# EAGLE design Hardware-Neuron (EAGLE 9.3.0)
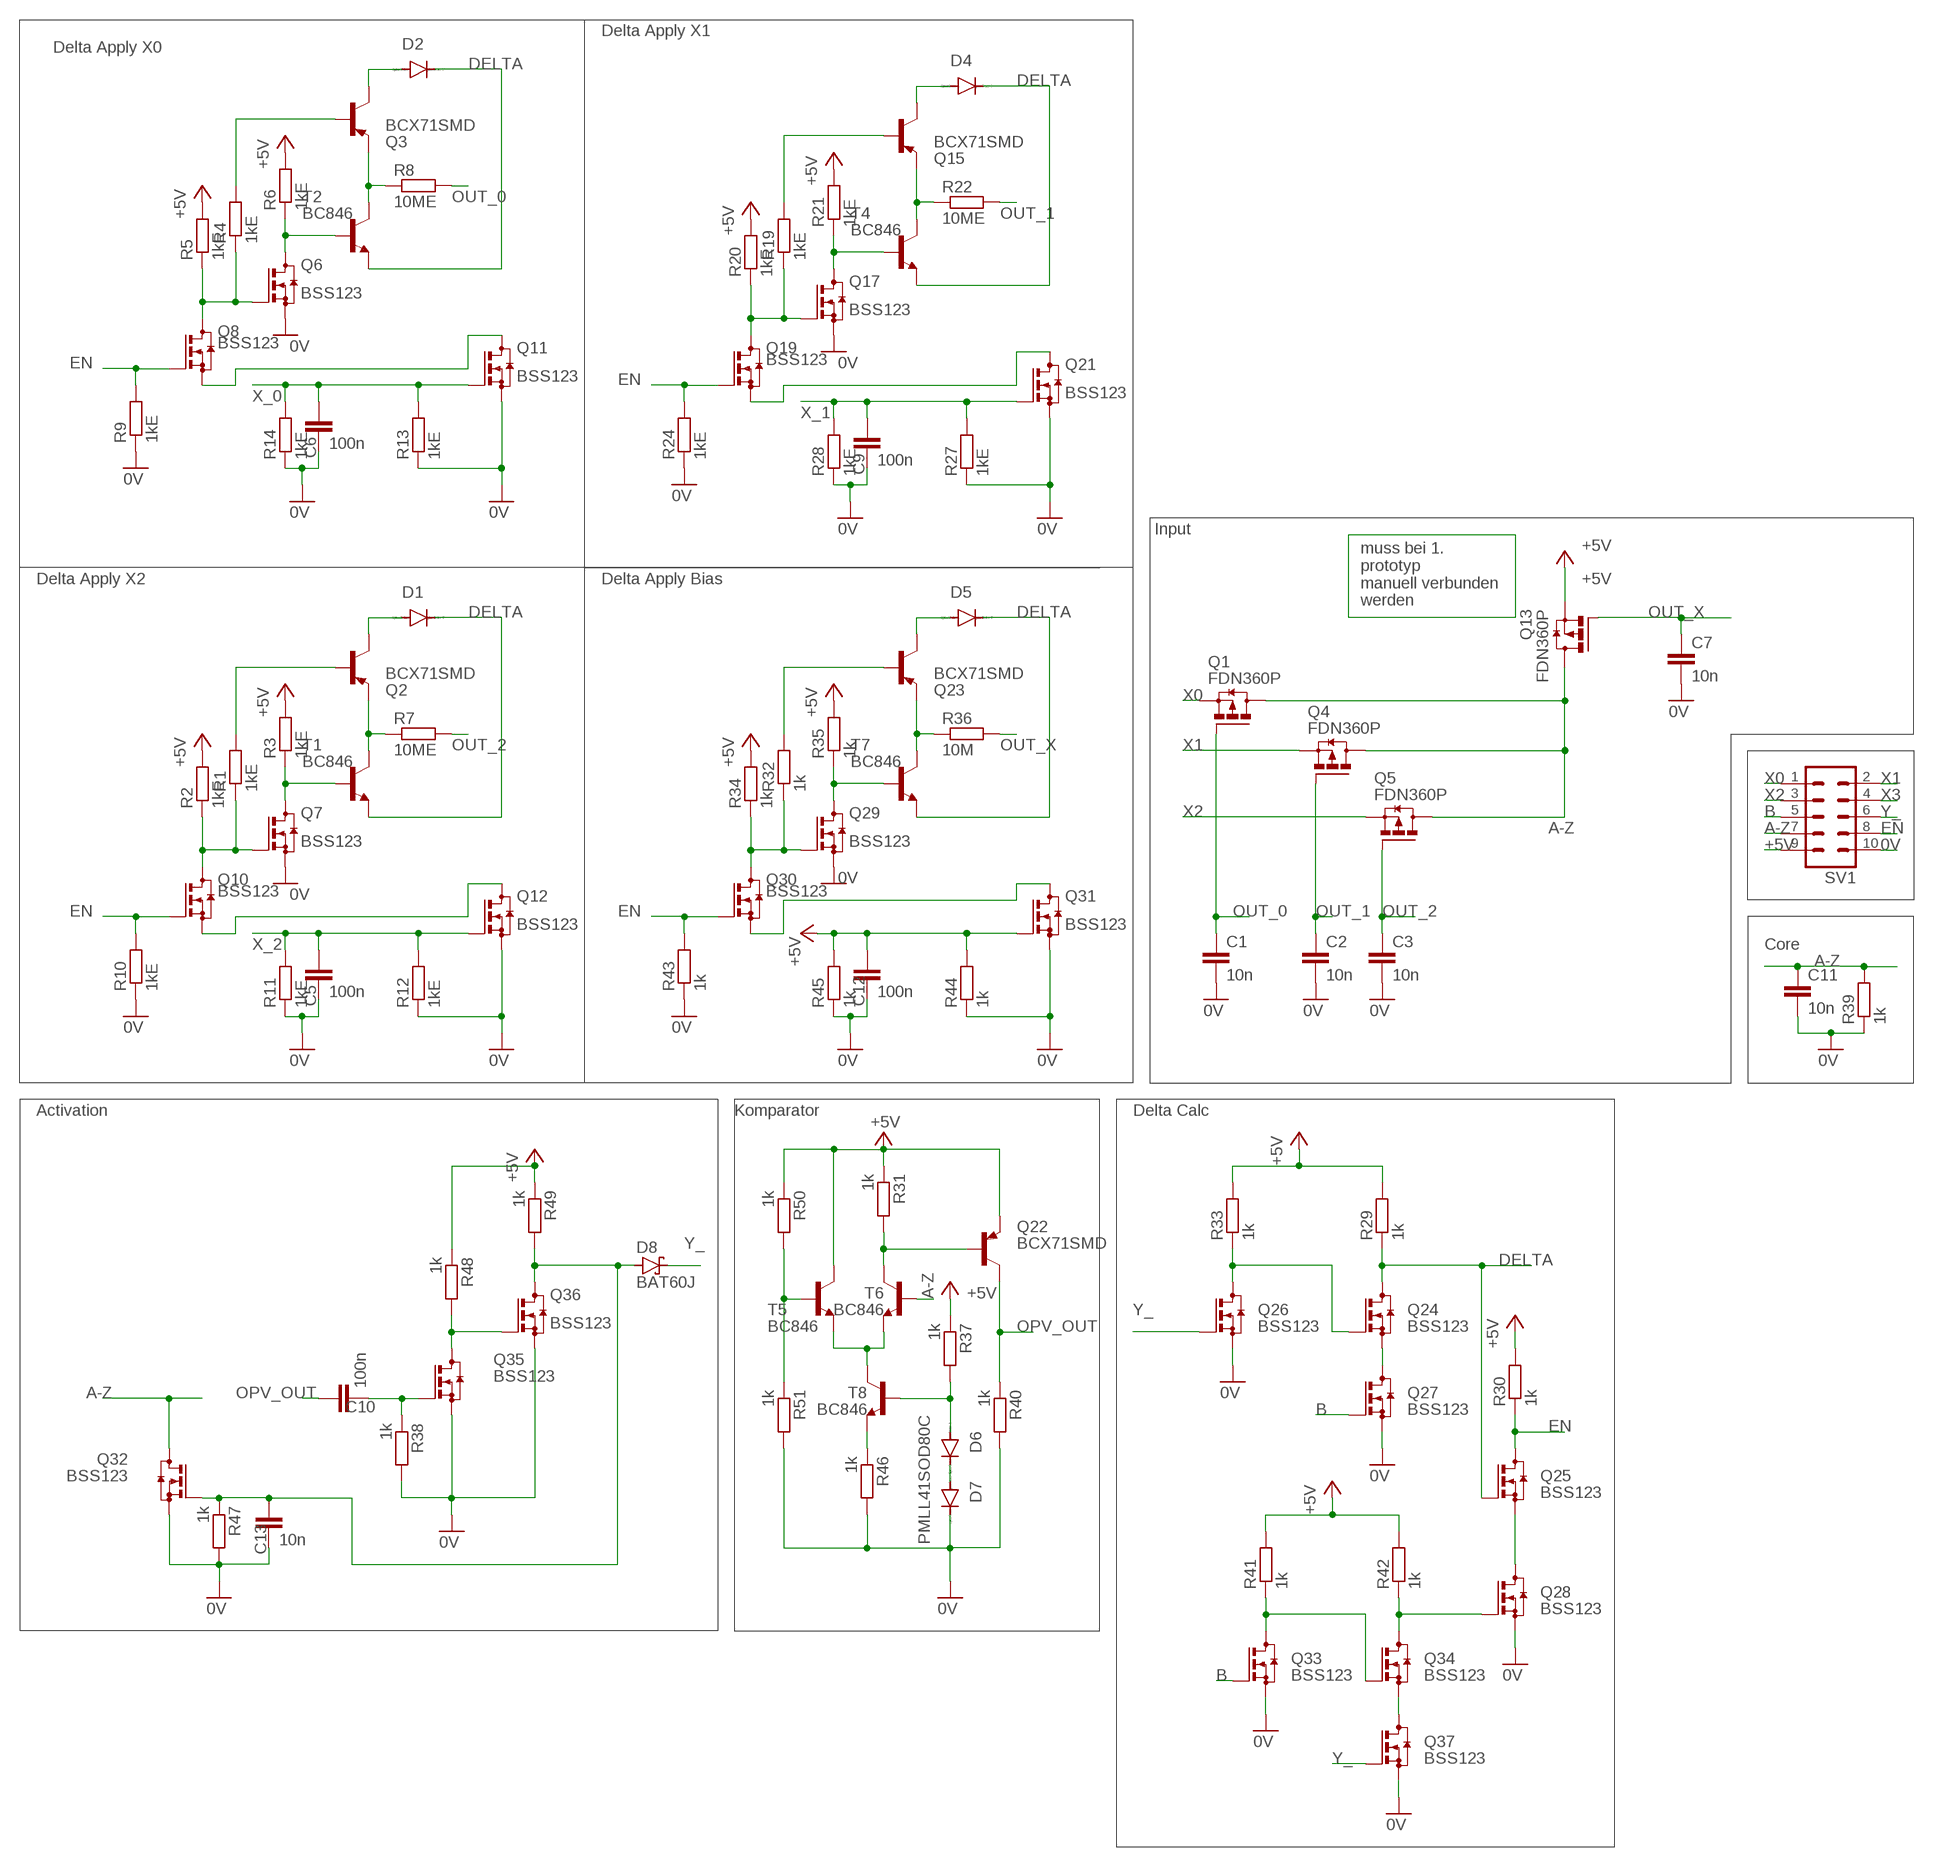
[diagram p0: schematic, sheet 1]

## Parts
C1  10n  C-EUC0805  [C0805]
C2  10n  C-EUC0805  [C0805]
C3  10n  C-EUC0805  [C0805]
C5  100n  C-EUC0805  [C0805]
C6  100n  C-EUC0805  [C0805]
C7  10n  C-EUC0805  [C0805]
C9  100n  C-EUC0805  [C0805]
C10  100n  C-EUC0805  [C0805]
C11  10n  C-EUC0805  [C0805]
C12  100n  C-EUC0805  [C0805]
C13  10n  C-EUC0805  [C0805]
D1  PMLL41SOD80C  [SOD80C]
D2  PMLL41SOD80C  [SOD80C]
D4  PMLL41SOD80C  [SOD80C]
D5  PMLL41SOD80C  [SOD80C]
D6  PMLL41SOD80C  [SOD80C]
D7  PMLL41SOD80C  [SOD80C]
D8  BAT60J  [SOD323_ST]
Q1  FDN360P  [SUPER-SOT3]
Q2  BCX71SMD  [SOT23]
Q3  BCX71SMD  [SOT23]
Q4  FDN360P  [SUPER-SOT3]
Q5  FDN360P  [SUPER-SOT3]
Q6  BSS123  [SOT23]
Q7  BSS123  [SOT23]
Q8  BSS123  [SOT23]
Q10  BSS123  [SOT23]
Q11  BSS123  [SOT23]
Q12  BSS123  [SOT23]
Q13  FDN360P  [SUPER-SOT3]
Q15  BCX71SMD  [SOT23]
Q17  BSS123  [SOT23]
Q19  BSS123  [SOT23]
Q21  BSS123  [SOT23]
Q22  BCX71SMD  [SOT23]
Q23  BCX71SMD  [SOT23]
Q24  BSS123  [SOT23]
Q25  BSS123  [SOT23]
Q26  BSS123  [SOT23]
Q27  BSS123  [SOT23]
Q28  BSS123  [SOT23]
Q29  BSS123  [SOT23]
Q30  BSS123  [SOT23]
Q31  BSS123  [SOT23]
Q32  BSS123  [SOT23]
Q33  BSS123  [SOT23]
Q34  BSS123  [SOT23]
Q35  BSS123  [SOT23]
Q36  BSS123  [SOT23]
Q37  BSS123  [SOT23]
R1  1kE  R-EU_M0805  [M0805]
R2  1kE  R-EU_M0805  [M0805]
R3  1kE  R-EU_M0805  [M0805]
R4  1kE  R-EU_M0805  [M0805]
R5  1kE  R-EU_M0805  [M0805]
R6  1kE  R-EU_M0805  [M0805]
R7  10ME  R-EU_M0805  [M0805]
R8  10ME  R-EU_M0805  [M0805]
R9  1kE  R-EU_M0805  [M0805]
R10  1kE  R-EU_M0805  [M0805]
R11  1kE  R-EU_M0805  [M0805]
R12  1kE  R-EU_M0805  [M0805]
R13  1kE  R-EU_M0805  [M0805]
R14  1kE  R-EU_M0805  [M0805]
R19  1kE  R-EU_M0805  [M0805]
R20  1kE  R-EU_M0805  [M0805]
R21  1kE  R-EU_M0805  [M0805]
R22  10ME  R-EU_M0805  [M0805]
R24  1kE  R-EU_M0805  [M0805]
R27  1kE  R-EU_M0805  [M0805]
R28  1kE  R-EU_M0805  [M0805]
R29  1k  R-EU_M0805  [M0805]
R30  1k  R-EU_M0805  [M0805]
R31  1k  R-EU_M0805  [M0805]
R32  1k  R-EU_M0805  [M0805]
R33  1k  R-EU_M0805  [M0805]
R34  1k  R-EU_M0805  [M0805]
R35  1k  R-EU_M0805  [M0805]
R36  10M  R-EU_M0805  [M0805]
R37  1k  R-EU_M0805  [M0805]
R38  1k  R-EU_M0805  [M0805]
R39  1k  R-EU_M0805  [M0805]
R40  1k  R-EU_M0805  [M0805]
R41  1k  R-EU_M0805  [M0805]
R42  1k  R-EU_M0805  [M0805]
R43  1k  R-EU_M0805  [M0805]
R44  1k  R-EU_M0805  [M0805]
R45  1k  R-EU_M0805  [M0805]
R46  1k  R-EU_M0805  [M0805]
R47  1k  R-EU_M0805  [M0805]
R48  1k  R-EU_M0805  [M0805]
R49  1k  R-EU_M0805  [M0805]
R50  1k  R-EU_M0805  [M0805]
R51  1k  R-EU_M0805  [M0805]
SV1  ML10  [ML10]
T1  BC846  [SOT23]
T2  BC846  [SOT23]
T4  BC846  [SOT23]
T5  BC846  [SOT23]
T6  BC846  [SOT23]
T7  BC846  [SOT23]
T8  BC846  [SOT23]

## Nets
0V: C1.2 C2.2 C3.2 C5.2 C6.2 C7.2 C9.2 C11.2 C12.2 C13.2 D7.C Q6.2(S) Q7.2(S) Q11.2(S) Q12.2(S) Q17.2(S) Q21.2(S) Q26.2(S) Q27.2(S) Q28.2(S) Q29.2(S) Q31.2(S) Q32.2(S) Q33.2(S) Q35.2(S) Q36.2(S) Q37.2(S) R9.1 R10.1 R11.1 R12.1 R13.1 R14.1 R24.1 R27.1 R28.1 R38.2 R39.1 R40.2 R43.1 R44.1 R45.1 R46.2 R47.2 R51.2 SV1.10
+5V: C12.1 Q13.2(S) Q22.2(E) Q31.1(G) R2.2 R3.2 R5.2 R6.2 R20.2 R21.2 R29.2 R30.2 R31.1 R33.2 R34.2 R35.2 R37.1 R41.2 R42.2 R44.2 R45.2 R48.1 R49.1 R50.1 SV1.9 T5.3(C)
A-Z: C11.1 Q1.3(D) Q4.3(D) Q5.3(D) Q13.3(D) Q32.3(D) R39.2 SV1.7 T6.1(B)
B: Q27.1(G) Q33.1(G) SV1.5
DELTA: D1.C D2.C D4.C D5.C Q24.3(D) Q25.1(G) R29.1 T1.2(E) T2.2(E) T4.2(E) T7.2(E)
EN: Q8.1(G) Q10.1(G) Q19.1(G) Q25.3(D) Q30.1(G) R9.2 R10.2 R24.2 R30.1 R43.2 SV1.8
N$1: Q29.3(D) R35.1 T7.1(B)
N$2: Q23.2(E) R36.1 T7.3(C)
N$3: C10.2 Q35.1(G) R38.1
N$5: Q35.3(D) Q36.1(G) R48.2
N$6: Q6.3(D) R6.1 T2.1(B)
N$7: Q8.2(S) Q11.3(D)
N$8: Q3.2(E) R8.1 T2.3(C)
N$9: D5.A Q23.3(C)
N$10: Q23.1(B) R32.2
N$11: Q29.1(G) Q30.3(D) R32.1 R34.1
N$12: Q30.2(S) Q31.3(D)
N$13: D6.C D7.A
N$14: R50.2 R51.1 T5.1(B)
N$16: C13.1 D8.A Q32.1(G) Q36.3(D) R47.1 R49.2
N$25: R46.1 T8.2(E)
N$26: Q22.1(B) R31.2 T6.3(C)
N$27: T5.2(E) T6.2(E) T8.3(C)
N$28: Q17.3(D) R21.1 T4.1(B)
N$29: D6.A R37.2 T8.1(B)
N$30: Q24.1(G) Q26.3(D) R33.1
N$31: D2.A Q3.3(C)
N$32: Q24.2(S) Q27.3(D)
N$33: Q15.2(E) R22.1 T4.3(C)
N$34: Q3.1(B) R4.2
N$35: Q6.1(G) Q8.3(D) R4.1 R5.1
N$36: Q28.1(G) Q34.3(D) R42.1
N$37: Q33.3(D) Q34.1(G) R41.1
N$38: D4.A Q15.3(C)
N$39: Q15.1(B) R19.2
N$40: Q25.2(S) Q28.3(D)
N$41: Q17.1(G) Q19.3(D) R19.1 R20.1
N$42: Q19.2(S) Q21.3(D)
N$43: Q34.2(S) Q37.3(D)
N$50: Q7.3(D) R3.1 T1.1(B)
N$51: Q2.2(E) R7.1 T1.3(C)
N$52: D1.A Q2.3(C)
N$53: Q2.1(B) R1.2
N$54: Q7.1(G) Q10.3(D) R1.1 R2.1
N$55: Q10.2(S) Q12.3(D)
OPV_OUT: C10.1 Q22.3(C) R40.1
OUT_0: C1.1 Q1.1(G) R8.2
OUT_1: C2.1 Q4.1(G) R22.2
OUT_2: C3.1 Q5.1(G) R7.2
OUT_X: C7.1 Q13.1(G) R36.2
X0: Q1.2(S) SV1.1
X1: Q4.2(S) SV1.2
X2: Q5.2(S) SV1.3
X3: SV1.4
X_0: C6.1 Q11.1(G) R13.2 R14.2
X_1: C9.1 Q21.1(G) R27.2 R28.2
X_2: C5.1 Q12.1(G) R11.2 R12.2
Y_: D8.C Q26.1(G) Q37.1(G) SV1.6

## Notes on the sheet
- Delta Apply X1
- Delta Apply X0
- Input
- Delta Apply X2 | Delta Apply Bias
- muss bei 1.
  prototyp 
  manuell verbunden
  werden
- Core
- Activation | Komparator | Delta Calc

## Library data of the parts
C1-C3 C5-C7 C9-C13 = rcl:C-EU: CAPACITOR, European symbol; SPICEPREFIX: C
D1 D2 D4-D7 = diode:PMLL41*: High-speed diodes Source: http://www.semiconductors.philips.com/acrobat_download/datasheets/PMLL4150_2.pdf
D8 = diode:BAT60J: Schottky barrier diode Source: www.st.com, BAT60J.pdf
Q1 Q4 Q5 Q13 = transistor-power:FDN360P: Single P-Channel, PowerTrench (R) MOSFET Source: http://www.fairchildsemi.com/ds/FD/FDN360P.pdf
Q2 Q3 Q15 Q22 Q23 = transistor-pnp:BCX71SMD: PNP Transistor
Q6-Q8 Q10-Q12 Q17 Q19 Q21 Q24-Q37 = transistor-small-signal:BSS123: N-CHANNEL MOS FET
R1-R14 R19-R22 R24 R27-R51 = rcl:R-EU_: RESISTOR, European symbol; SPICEPREFIX: R
SV1 = con-harting-ml:ML10: HARTING; OC_FARNELL: unknown; OC_NEWARK: unknown
T1 T2 T4-T8 = transistor:BC846: NPN TRANSISTOR

## Board
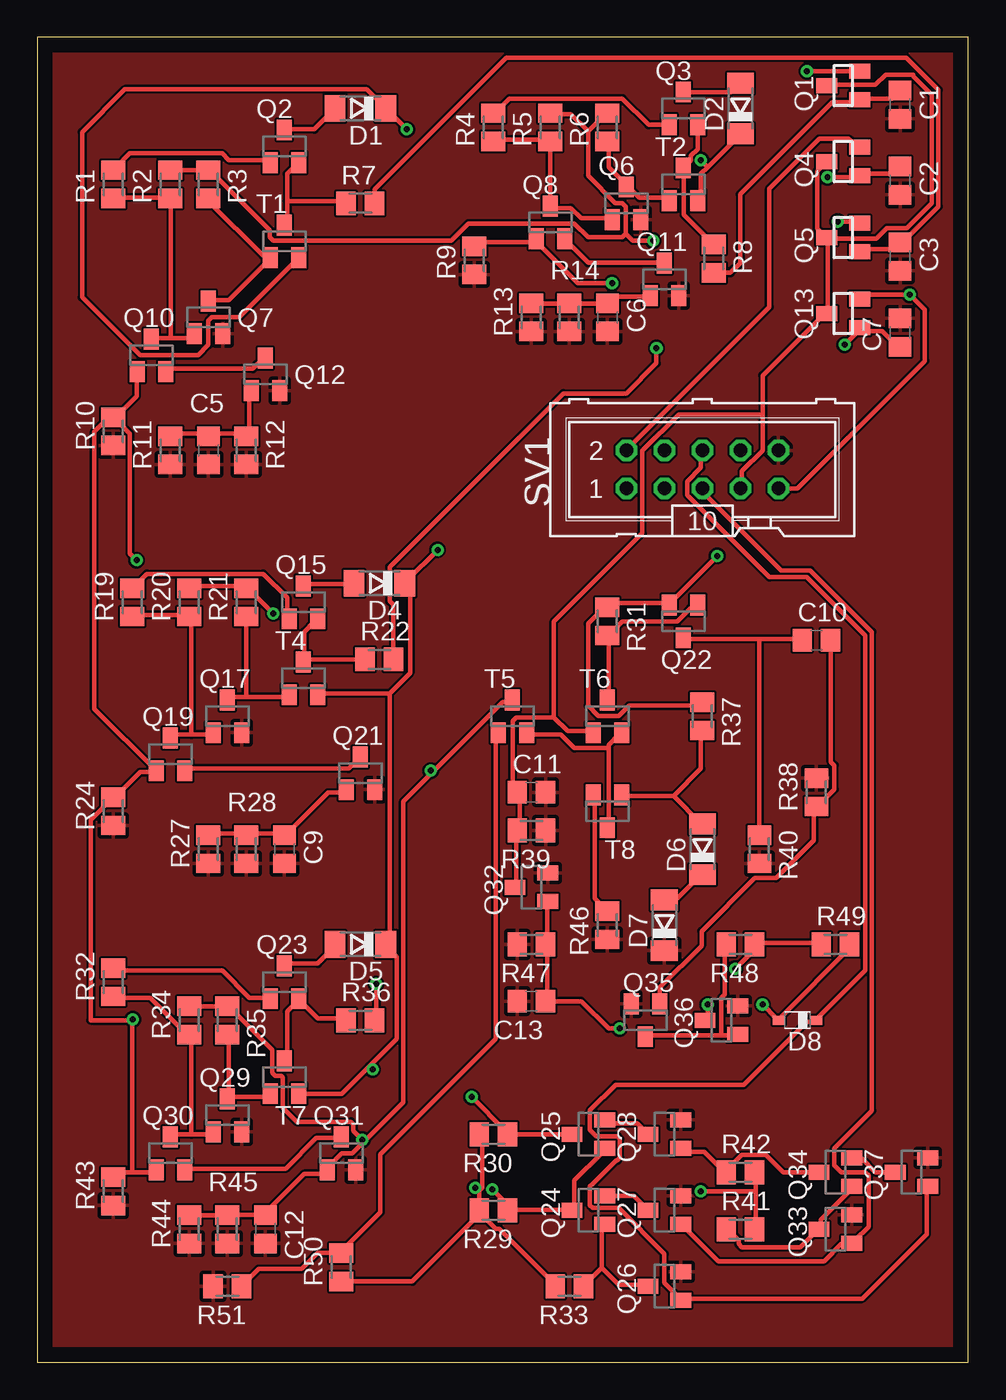
[diagram p1: board, top side]
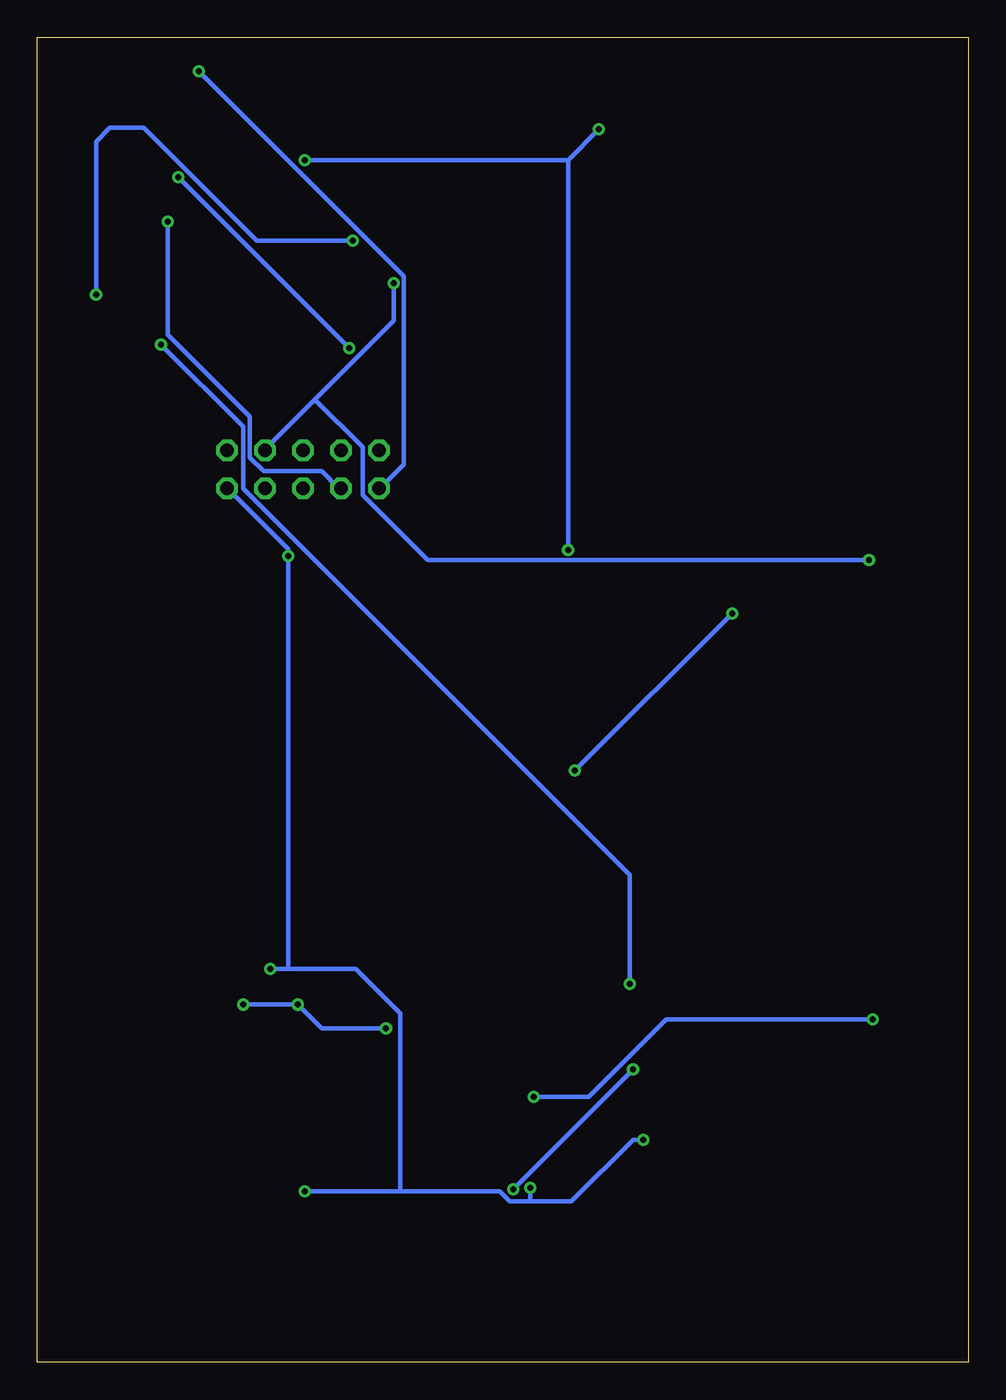
[diagram p2: board, bottom side, seen from below]

Size 62.21 x 88.57 mm. Coordinates in mm from the lower left corner, seen from the top.
Outline: 0,0 62.21,0 62.21,88.57 0,88.57 0,0
Copper layers (1*16): Top 0.035mm / dielectric 1.5mm / Bottom 0.035mm
Design rules "default *": minimum track width 12mil, minimum drill 0.35mm, track to track 6mil, track to pad 6mil, pad to pad 6mil, via to via 6mil, smd to smd 6mil, copper to edge 40mil, drill to drill 6mil, minimum pad ring 10mil, minimum via ring 8mil, stop-mask expansion 4mil, vias tented up to drill 0mil, thermal gap 10mil

### Footprints (pad centres in the part's own frame; a part is rotated, then mirrored left to right if it is on the bottom)
C0805 = smd 1.3 x 1.5: 1 -0.95,0; 2 0.95,0
SOD80C = smd 1.4 x 1.8: A 1.7,0; C -1.7,0
SOD323_ST = smd 0.8 x 0.6: A 1.25,0; C -1.25,0
SUPER-SOT3 = smd 1 x 1.4: 1 -0.95,-1.1; 2 0.95,-1.1; 3 0,1.1
SOT23 = smd 1 x 1.4: 1 -0.95,-1.1; 2 0.95,-1.1; 3 0,1.1
M0805 = smd 1.3 x 1.6: 1 -0.95,0; 2 0.95,0
ML10 = drill 0.914 octagon: 1 -5.08,-1.27; 2 -5.08,1.27; 3 -2.54,-1.27; 4 -2.54,1.27; 5 0,-1.27; 6 0,1.27; 7 2.54,-1.27; 8 2.54,1.27; 9 5.08,-1.27; 10 5.08,1.27

### Placement (x,y rotation side)
C1  57.66,84.07 270 top
C2  57.66,78.99 270 top
C3  57.66,73.91 270 top
C5  11.43,60.96 270 top
C6  38.1,69.85 270 top
C7  57.66,68.83 90 top
C9  16.51,34.29 270 top
C10  52.07,48.26 0 top
C11  33.02,38.1 0 top
C12  15.24,8.89 270 top
C13  33.02,24.13 180 top
D1  21.59,83.82 180 top
D2  46.99,83.82 90 top
D4  22.86,52.07 180 top
D5  21.59,27.94 180 top
D6  44.45,34.29 90 top
D7  41.91,29.21 90 top
D8  50.8,22.86 180 top
Q1  53.85,85.34 90 top
Q2  16.51,81.28 0 top
Q3  43.18,83.82 0 top
Q4  53.85,80.26 90 top
Q5  53.85,75.18 90 top
Q6  39.37,77.47 0 top
Q7  11.43,69.85 0 top
Q8  34.29,76.2 0 top
Q10  7.62,67.31 0 top
Q11  41.91,72.39 0 top
Q12  15.24,66.04 0 top
Q13  53.85,70.1 90 top
Q15  17.78,50.8 0 top
Q17  12.7,43.18 0 top
Q19  8.89,40.64 0 top
Q21  21.59,39.37 0 top
Q22  43.18,49.53 180 top
Q23  16.51,25.4 0 top
Q24  36.83,10.16 90 top
Q25  36.83,15.24 90 top
Q26  41.91,5.08 90 top
Q27  41.91,10.16 90 top
Q28  41.91,15.24 90 top
Q29  12.7,16.51 0 top
Q30  8.89,13.97 0 top
Q31  20.32,13.97 0 top
Q32  33.02,31.75 90 top
Q33  53.34,8.89 90 top
Q34  53.34,12.7 90 top
Q35  40.64,22.86 180 top
Q36  45.72,22.86 90 top
Q37  58.42,12.7 90 top
R1  5.08,78.74 90 top
R2  8.89,78.74 90 top
R3  11.43,78.74 90 top
R4  30.48,82.55 90 top
R5  34.29,82.55 90 top
R6  38.1,82.55 90 top
R7  21.59,77.47 0 top
R8  45.21,73.79 270 top
R9  29.21,73.66 90 top
R10  5.08,62.23 90 top
R11  8.89,60.96 90 top
R12  13.97,60.96 90 top
R13  33.02,69.85 90 top
R14  35.56,69.85 90 top
R19  6.35,50.8 90 top
R20  10.16,50.8 90 top
R21  13.97,50.8 90 top
R22  22.86,46.99 0 top
R24  5.08,36.83 90 top
R27  11.43,34.29 90 top
R28  13.97,34.29 90 top
R29  30.48,10.16 180 top
R30  30.48,15.24 180 top
R31  38.1,49.53 270 top
R32  5.08,25.4 90 top
R33  35.56,5.08 180 top
R34  10.16,22.86 90 top
R35  12.7,22.86 90 top
R36  21.59,22.86 0 top
R37  44.45,43.18 270 top
R38  52.07,38.1 90 top
R39  33.02,35.56 180 top
R40  48.26,34.29 270 top
R41  46.99,8.89 0 top
R42  46.99,12.7 0 top
R43  5.08,11.43 90 top
R44  10.16,8.89 90 top
R45  12.7,8.89 90 top
R46  38.1,29.21 270 top
R47  33.02,27.94 180 top
R48  46.99,27.94 180 top
R49  53.34,27.94 0 top
R50  20.32,6.35 90 top
R51  12.7,5.08 180 top
SV1  44.45,59.69 0 top
T1  16.51,74.93 0 top
T2  43.18,78.74 0 top
T4  17.78,45.72 0 top
T5  31.75,43.18 0 top
T6  38.1,43.18 0 top
T7  16.51,19.05 0 top
T8  38.1,36.83 180 top

### Tracks (layer width: path | path; a pad name or v marks a point on that pad's centre or on a via)
0V
  Top 0.305: 57.61,77.85 C2.2 | 42.75,71.22 Q11.2 | 11.43,33.5 R27.1 | 13.72,41.96 Q17.2 | 51.89,38.99 R38.2 | 34.06,32.82 Q32.2 | 37.95,28.25 R46.2 | 47.78,33.27 48.23,33.27 R40.2 | 59.44,13.61 Q37.2 | 46.86,23.67 Q36.2 | 42.98,16.36 Q28.2 | 39.55,23.9 Q35.2
  pour Top: -2.54,-2.54 64.77,-2.54 64.77,91.44 -2.54,91.44
+5V  (via drill 0.4)
  Top 0.305: R49.1 52.35,28.02 48.01,28.02 R48.1 47.78,27.89 47.78,27.43 v46.63,26.29 | R33.2 34.52,5.26 30.86,8.91 30.63,8.91 29.53,10.02 R29.2 | 29.72,11.66 29.72,15.09 R30.2 | 48.01,11.43 48.01,12.57 R42.2 | 48.01,11.43 48.01,9.14 R41.2 | R20.2 10.29,51.89 13.95,51.89 R21.2 14.17,51.66 v15.77,50.06 | R34.2 10.29,23.77 12.57,23.77 R35.2 12.77,23.81 15.71,20.87 15.71,19.32 15.88,19.14 16.29,19.14 16.4,19.03 16.4,17 17.32,16.07 20.95,16.07 21.12,15.9 21.12,15.45 v21.72,14.86 21.95,14.86 | R44.2 10.29,9.83 12.57,9.83 R45.2 C12.1 15.24,9.98 17.83,12.57 19.2,12.57 Q31.1 19.43,13.03 20.34,13.95 21.03,13.95 21.95,14.86 | 26.52,39.55 24.46,37.49 24.46,17.37 21.95,14.86 | 26.52,39.55 31.09,44.12 31.55,44.12 T5.3 | 26.52,39.55 v26.29,39.55 | v44.35,11.43 48.01,11.43 | v29.26,11.66 29.72,11.66 | 39.32,75.44 39.09,75.21 36.8,75.21 35.89,76.12 28.8,76.12 27.66,74.98 15.77,74.98 15.54,75.21 15.54,75.67 11.52,79.69 R3.2 R2.2 | 39.32,75.44 39.32,77.27 39.09,77.5 38.63,77.5 36.8,79.32 36.8,82.3 | 36.8,82.3 37.95,83.44 R6.2 | 36.8,82.3 35.66,83.44 34.29,83.44 R5.2 | R37.1 44.35,43.89 39.55,43.89 38.86,43.2 37.49,43.2 36.8,43.89 36.8,49.38 37.95,50.52 R31.1 38.18,50.75 42.06,50.75 Q22.2 42.29,50.75 v45.44,53.9 | 39.32,75.44 39.78,74.98 v41.15,74.98 | R29.2 29.53,9.87 25.06,5.4 R50.1 | 29.72,11.66 29.53,11.47 R29.2 | SV1.9 50.8,58.42 59.31,66.93 59.31,70.36 v58.29,71.37 55.27,71.37 Q13.2
  Bottom 0.305: v26.29,39.55 v15.77,50.06 | 37.95,11.43 31.32,11.43 30.63,10.74 29.26,10.74 | 37.95,11.43 v44.35,11.43 | 29.26,10.74 26.52,10.74 22.4,14.86 v21.72,14.86 | 45.44,26.29 40.92,26.29 37.95,23.32 37.95,11.43 | 45.44,26.29 v46.63,26.29 | 29.26,10.74 v29.26,11.66 | SV1.9 49.38,58.29 45.44,54.36 v45.44,53.9 45.44,26.29 | v41.15,74.98 47.55,74.98 55.09,82.53 57.38,82.53 58.29,81.61 v58.29,71.37
A-Z
  Top 0.305: Q32.3 32,31.9 32,35.56 R39.2 32.23,35.56 32.23,38.08 C11.1 32,38.3 31.77,38.53 31.77,42.88 32,43.1 34.52,43.1 | 34.52,43.1 35.43,42.19 37.03,42.19 T6.1 | 52.81,75.11 52.81,70.31 Q13.3 52.58,70.08 48.46,65.96 48.46,63.35 | 52.81,75.11 Q5.3 52.58,75.34 52.12,75.79 52.12,79.64 Q4.3 52.81,80.37 | 58.52,86.08 58.42,86.08 | 58.42,86.08 56.69,86.08 56.01,85.39 52.81,85.39 Q1.3 | 48.46,63.35 48.46,60.94 47.09,59.56 47.09,58.42 SV1.7 | 48.46,63.35 42.85,63.35 40.44,60.94 40.44,55.42 34.52,49.51 34.52,43.1 | 58.42,86.08 58.52,85.98 58.53,85.98 59.77,84.75 59.77,77.47 58.12,75.82 56.78,75.82 56.07,75.11 52.81,75.11
B
  Top 0.305: Q27.1 43.2,9.04 45.49,6.76 52.58,6.76 53.72,7.9 54.41,7.9 Q33.1 54.63,8.13 55.55,9.04 55.55,12.47 55.32,12.7 53.72,12.7 53.26,13.16 53.26,14.3 55.78,16.82 55.78,48.82 51.66,52.93 49.71,52.93 44.45,58.19 SV1.5
DELTA  (via drill 0.4)
  Top 0.305: 44.81,79.91 46.86,81.97 D2.C | 44.81,79.91 44.35,79.45 44.35,77.85 T2.2 | T1.2 17.37,73.74 13.49,69.85 11.66,69.85 11.43,69.62 11.43,68.02 10.74,67.33 6.86,67.33 3,71.2 3,82.25 5.84,85.09 22.02,85.09 D1.C 23.32,83.8 v24.69,82.42 | v44.35,80.37 44.81,79.91 | 23.55,44.7 18.75,44.7 T4.2 | 23.55,44.7 24.92,46.08 24.92,51.79 24.69,52.02 D4.C 24.69,52.25 v26.75,54.3 | Q25.1 37.72,14.07 37.72,13.97 35.89,12.14 35.89,10.19 Q24.3 35.66,10.19 31.55,10.19 R29.1 31.32,10.19 31.32,10.64 v30.4,11.56 | 22.17,19.79 24,21.61 24,27.1 23.32,27.79 D5.C 23.32,28.02 23.55,28.25 23.55,44.7 | 22.17,19.79 v22.4,19.56 | T7.2 20.34,17.95 22.17,19.79
  Bottom 0.305: 26.75,80.37 v44.35,80.37 | v24.69,82.42 26.75,80.37 | v22.4,19.56 v30.4,11.56 | v26.75,54.3 26.75,80.37
EN  (via drill 0.4)
  Top 0.305: R9.2 29.26,74.65 29.49,74.88 33.15,74.88 Q8.1 33.38,74.88 36.12,72.14 v38.41,72.14 | Q10.1 6.63,66.19 6.63,64.59 5.26,63.22 R10.2 | Q25.3 35.66,15.21 31.55,15.21 R30.1 31.32,15.44 v29.03,17.73 | 6.35,12.7 5.49,12.7 5.26,12.47 R43.2 | 6.35,12.7 7.77,12.7 Q30.1 | R10.2 5.26,62.99 6.18,62.06 6.18,54.06 v6.63,53.62 | R10.2 4.76,63.18 3.81,62.23 3.81,43.67 Q19.1 7.77,39.45 6.86,39.45 5.26,37.85 R24.2 3.56,36.26 3.56,22.86 6.35,22.86 | v6.38,22.91 6.35,22.89 6.35,22.86 | 6.35,12.7 6.35,22.86
  Bottom 0.305: 43.66,64.36 38.41,69.62 v38.41,72.14 | 43.66,64.36 46.86,61.16 SV1.8 | v29.03,17.73 25.38,17.73 20.19,22.91 v6.38,22.91 | 43.66,64.36 40.46,61.16 40.46,57.96 36.12,53.62 v6.63,53.62
N$1
  Top 0.305: 12.8,17.73 15.54,17.73 T7.1 | 12.8,17.73 12.8,21.84 R35.1 | 12.8,17.73 Q29.3
N$2
  Top 0.305: T7.3 16.69,20.24 16.69,23.44 17.37,24.13 Q23.2 17.6,24.13 18.75,22.99 20.57,22.99 R36.1
N$3
  Top 0.305: Q35.1 41.6,24.13 41.6,25.04 44.4,27.84 44.4,28.8 47.95,32.36 49.38,32.36 51.89,34.87 51.89,36.93 R38.1 52.12,37.16 53.26,38.3 53.26,39.9 53.03,40.13 53.03,48.13 C10.2
N$5
  Top 0.305: 45.72,21.84 46.63,21.84 Q36.1 | 45.72,21.84 40.69,21.84 Q35.3 | 45.72,21.84 45.72,24.36 45.95,24.59 45.95,27.79 R48.2
N$6
  Top 0.305: T2.1 42.06,77.85 40.23,77.85 39.55,78.54 Q6.3 39.32,78.77 38.18,79.91 38.18,81.51 R6.1
N$7
  Top 0.305: Q11.3 41.83,73.51 36.8,73.51 35.43,74.88 Q8.2
N$8
  Top 0.305: Q3.2 44.12,82.57 44.12,81.11 43.66,80.65 43.66,80.33 T2.3 43.2,79.68 43.2,76.71 45.03,74.88 R8.1
N$9
  Top 0.305: Q23.3 16.69,26.64 18.75,26.64 19.89,27.79 D5.A
N$10
  Top 0.305: Q23.1 15.54,24.36 14.17,24.36 12.34,26.19 5.26,26.19 R32.2
N$11
  Top 0.305: 10.29,15.21 11.66,15.21 Q29.1 | 10.29,15.21 8.91,15.21 Q30.3 | R32.1 5.26,24.36 7.54,24.36 10.06,21.84 R34.1 10.29,21.84 10.29,15.21
N$12
  Top 0.305: Q30.2 10.06,12.93 16.59,12.93 18.64,14.99 20.12,14.99 Q31.3
N$13
  Top 0.305: D7.A 42.06,30.99 42.75,30.99 44.35,32.59 D6.C
N$14
  Top 0.305: T5.1 30.63,41.96 30.63,21.61 22.92,13.91 22.92,10.02 20.34,7.44 R50.2 18.73,7.3 17.65,6.22 14.79,6.22 R51.1 13.72,5.16
N$16  (via drill 0.4)
  Top 0.305: Q32.1 34.06,30.76 34.06,28.02 R47.1 34.06,27.79 34.06,24.13 | R49.2 54.41,27.79 49.61,22.99 D8.A 49.38,22.99 v48.46,23.9 | v44.81,23.9 44.81,22.99 Q36.3 | 34.06,24.13 36.35,24.13 38.18,22.3 v38.91,22.3 | 34.06,24.13 C13.1
  Bottom 0.305: v48.46,23.9 v44.81,23.9 43.2,22.3 v38.91,22.3
N$25
  Top 0.305: T8.2 37.26,37.85 37.26,30.99 37.95,30.3 R46.1
N$26
  Top 0.305: T6.3 38.18,44.48 38.18,48.36 R31.2 38.18,48.59 39.09,49.51 42.75,49.51 43.66,50.42 44.12,50.42 Q22.1
N$27
  Top 0.305: 38.18,41.05 38.18,41.27 38.86,41.96 T6.2 | 38.18,41.05 38.18,35.79 T8.3 | 38.18,41.05 35.89,41.05 34.98,41.96 32.92,41.96 T5.2
N$28
  Top 0.305: 13.95,44.48 16.69,44.48 T4.1 | 13.95,44.48 12.8,44.48 Q17.3 | 13.95,44.48 13.95,49.73 R21.1
N$29
  Top 0.305: 42.52,37.85 39.09,37.85 T8.1 | 42.52,37.85 44.35,36.02 D6.A | 42.52,37.85 44.35,39.67 44.35,42.19 R37.2
N$30
  Top 0.305: 37.72,6.3 37.72,9.04 Q24.1 | 37.72,6.3 36.58,5.16 R33.1 | 37.72,6.3 38.86,5.16 40.69,5.16 Q26.3
N$31
  Top 0.305: Q3.3 46.39,84.92 D2.A
N$32
  Top 0.305: Q24.2 39.86,11.11 Q27.3
N$33
  Top 0.305: 17.83,46.99 17.83,48.82 18.52,49.51 Q15.2 | 17.83,46.99 R22.1 | 17.83,46.99 T4.3
N$34
  Top 0.305: R4.2 30.63,83.57 31.55,84.48 39.09,84.48 40.85,82.72 Q3.1
N$35
  Top 0.305: R4.1 30.63,81.74 34.29,81.74 R5.1 Q8.3 34.29,77.17 35.66,77.17 36.35,76.48 38.41,76.48 Q6.1
N$36
  Top 0.305: Q34.3 49.84,12.7 48.69,13.84 47.09,13.84 45.95,12.7 | 45.95,12.7 44.58,14.07 43.2,14.07 Q28.1 | 45.95,12.7 R42.1
N$37
  Top 0.305: Q34.1 54.41,11.56 52.35,9.5 52.35,9.04 Q33.3 52.12,8.81 50.98,7.67 47.09,7.67 46.86,7.9 46.86,8.13 46.18,8.81 R41.1
N$38
  Top 0.305: Q15.3 17.83,52.02 21.03,52.02 D4.A
N$39
  Top 0.305: Q15.1 16.69,49.73 16.69,51.1 15.09,52.7 7.32,52.7 6.4,51.79 R19.2
N$40
  Top 0.305: Q28.3 40.1,15.95 38.12,15.95 37.95,16.13 Q25.2
N$41
  Top 0.305: 10.29,41.96 11.66,41.96 Q17.1 | 10.29,41.96 8.91,41.96 Q19.3 | R19.1 6.4,49.96 10.06,49.96 R20.1 10.29,49.73 10.29,41.96
N$42
  Top 0.305: Q19.2 10.06,39.67 20.8,39.67 21.49,40.36 Q21.3
N$43
  Top 0.305: Q37.3 56.01,12.7 55.09,13.61 54.63,13.61 Q34.2
N$50
  Top 0.305: Q7.3 11.43,70.99 12.8,70.99 15.54,73.74 T1.1 15.54,73.97 15.09,73.97 11.43,77.62 R3.1
N$51
  Top 0.305: 16.69,77.62 16.69,79.45 17.37,80.14 Q2.2 | 16.69,77.62 16.69,76.25 T1.3 | 16.69,77.62 20.57,77.62 R7.1
N$52
  Top 0.305: Q2.3 16.69,82.42 18.52,82.42 19.89,83.8 D1.A
N$53
  Top 0.305: Q2.1 15.54,80.37 12.8,80.37 12.34,80.82 6.17,80.82 5.26,79.91 R1.2
N$54
  Top 0.305: 8.91,68.48 10.06,68.48 10.29,68.71 Q7.1 | 8.91,68.48 7.77,68.48 Q10.3 | R1.1 5.26,77.85 8.69,77.85 R2.1 8.91,77.62 8.91,68.48
N$55
  Top 0.305: Q10.2 8.69,66.42 14.4,66.42 15.09,67.11 Q12.3
OPV_OUT
  Top 0.305: 48.23,48.36 50.98,48.36 C10.1 | 48.23,48.36 43.2,48.36 Q22.3 | 48.23,48.36 48.23,35.33 R40.1
OUT_0
  Top 0.305: C1.1 57.61,84.94 57.15,84.48 55.09,84.48 Q1.1 54.86,84.25 53.14,84.25 46.97,78.08 46.97,73.48 46.32,72.84 R8.2
OUT_1  (via drill 0.4)
  Top 0.305: C2.1 57.61,79.91 57.15,79.45 55.09,79.45 Q4.1 54.86,79.22 v52.81,79.22 | R22.2 23.77,46.99 23.77,50.65 23.55,50.88 23.55,53.16 35.15,64.77 39.37,64.77 41.38,66.78 v41.38,67.79
  Bottom 0.305: v52.81,79.22 v41.38,67.79
OUT_2
  Top 0.305: Q5.1 55.09,74.42 57.38,74.42 57.61,74.65 C3.1 57.84,74.88 60.22,77.27 60.22,85.06 58.06,87.22 31.34,87.22 22.54,78.42 R7.2
OUT_X  (via drill 0.4)
  Top 0.305: C7.1 57.61,67.79 56.46,68.94 55.09,68.94 Q13.1 54.86,68.94 v53.95,68.02 | v22.63,25.27 22.63,22.99 R36.2
  Bottom 0.305: v22.63,25.27 22.63,32.59 48.46,58.42 48.46,62.53 v53.95,68.02
X0  (via drill 0.4)
  Top 0.305: v51.44,86.31 54.86,86.31 Q1.2
  Bottom 0.305: v51.44,86.31 37.72,72.59 37.72,60.02 39.32,58.42 SV1.1
X1
  Top 0.305: Q4.2 54.22,81.79 52.25,81.79 48.92,78.46 48.92,70.54 39.55,61.16 SV1.2
X2  (via drill 0.4)
  Top 0.305: v53.49,76.25 54.86,76.25 Q5.2
  Bottom 0.305: v53.49,76.25 53.49,68.71 48.01,63.22 48.01,60.48 47.09,59.56 43.2,59.56 42.06,58.42 SV1.3
X_0
  Top 0.305: R13.2 33.15,70.76 35.43,70.76 R14.2 35.66,70.76 37.95,70.76 C6.1 38.18,70.99 38.41,71.22 40.92,71.22 Q11.1
X_1
  Top 0.305: R27.2 11.43,35.33 13.95,35.33 R28.2 14.17,35.33 16.46,35.33 C9.1 16.69,35.33 19.43,38.08 20.57,38.08 Q21.1
X_2
  Top 0.305: 11.43,62.08 8.91,62.08 R11.2 | Q12.1 14.17,64.82 14.17,62.08 R12.2 13.95,62.08 11.43,62.08 | 11.43,62.08 C5.1
Y_
  Top 0.305: Q37.1 59.44,11.56 59.44,8.56 55.12,4.24 43.2,4.24 Q26.1 42.98,4.24 41.91,5.31 41.91,7.24 38.84,10.3 37.1,10.3 36.92,10.48 36.92,11.74 37.1,11.91 38.67,13.48 38.76,13.48 38.94,13.66 38.94,14.92 38.76,15.1 37.36,15.1 36.92,15.53 36.92,16.82 38.65,18.54 47.22,18.54 51.44,22.76 51.89,22.76 D8.C 52.12,22.99 55.32,26.19 55.32,48.59 51.44,52.48 48.92,52.48 43.43,57.96 43.43,58.88 44.35,59.79 44.35,60.94 SV1.6